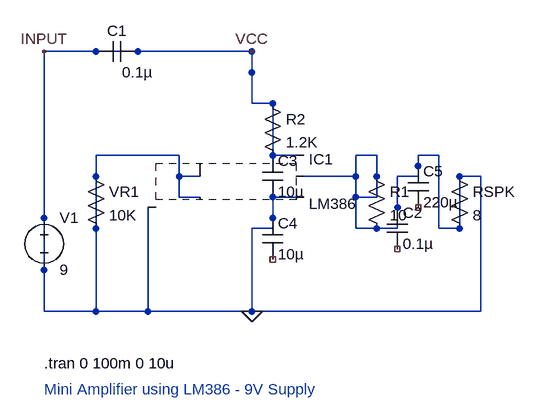
[diagram p0: schematic 35-lm386-amplifier_generated-by-claude-sonnet-4-6.asc]
35-lm386-amplifier_generated-by-claude-sonnet-4-6.asc, the LTspice schematic file:
Version 4
SHEET 1 880 680
WIRE 80 80 240 80
WIRE 80 80 80 480
WIRE 80 480 240 480
WIRE 240 80 400 80
WIRE 400 80 400 112
WIRE 240 480 400 480
WIRE 400 480 400 448
WIRE 160 320 160 480
WIRE 160 240 160 320
WIRE 160 240 240 240
WIRE 240 320 240 480
WIRE 240 240 288 240
WIRE 288 240 288 272
WIRE 288 272 320 272
WIRE 288 304 320 304
WIRE 288 272 288 304
WIRE 400 160 400 80
WIRE 400 160 432 160
WIRE 432 160 432 240
WIRE 432 240 480 240
WIRE 432 304 480 304
WIRE 432 304 432 352
WIRE 432 352 400 352
WIRE 400 352 400 448
WIRE 480 272 560 272
WIRE 560 272 560 240
WIRE 560 240 592 240
WIRE 592 240 592 304
WIRE 592 304 560 304
WIRE 560 304 560 272
WIRE 560 272 560 352
WIRE 560 352 624 352
WIRE 624 352 624 272
WIRE 624 272 656 272
WIRE 656 272 656 240
WIRE 656 240 688 240
WIRE 688 240 688 352
WIRE 688 352 720 352
WIRE 720 352 720 272
WIRE 720 272 752 272
WIRE 752 272 752 480
WIRE 752 480 400 480
FLAG 400 80 VCC
FLAG 400 480 0
FLAG 80 80 INPUT
SYMBOL voltage 80 320 R0
SYMATTR InstName V1
SYMATTR Value 9
SYMBOL cap 224 64 R90
WINDOW 0 0 32 VBottom 2
WINDOW 3 32 0 VTop 2
SYMATTR InstName C1
SYMATTR Value 0.1µ
SYMBOL res 144 256 R0
SYMATTR InstName VR1
SYMATTR Value 10K
SYMBOL AutoGenerated\LM386 384 272 R0
SYMATTR InstName IC1
SYMBOL res 416 144 R0
SYMATTR InstName R2
SYMATTR Value 1.2K
SYMBOL cap 416 240 R0
SYMATTR InstName C3
SYMATTR Value 10µ
SYMBOL cap 416 336 R0
SYMATTR InstName C4
SYMATTR Value 10µ
SYMBOL res 576 256 R0
SYMATTR InstName R1
SYMATTR Value 10
SYMBOL cap 608 320 R0
SYMATTR InstName C2
SYMATTR Value 0.1µ
SYMBOL cap 640 256 R0
SYMATTR InstName C5
SYMATTR Value 220µ
SYMBOL res 704 256 R0
SYMATTR InstName RSPK
SYMATTR Value 8
TEXT 80 560 Left 2 !.tran 0 100m 0 10u
TEXT 80 600 Left 2 ;Mini Amplifier using LM386 - 9V Supply

The netlist it stands for:
* 35-lm386-amplifier_generated-by-claude-sonnet-4-6.asc
V1 0 0 9
C1 0 0 0.1µ
R§VR1 0 0 10K
* IC1: LM386 (symbol AutoGenerated\LM386 not available, pin order unknown); nets seen at it: 0
R2 0 0 1.2K
C3 0 0 10µ
C4 0 NC_01 10µ
R1 0 0 10
C2 0 NC_02 0.1µ
C5 0 NC_03 220µ
RSPK 0 0 8
.tran 0 100m 0 10u
* Mini Amplifier using LM386 - 9V Supply
.backanno
.end